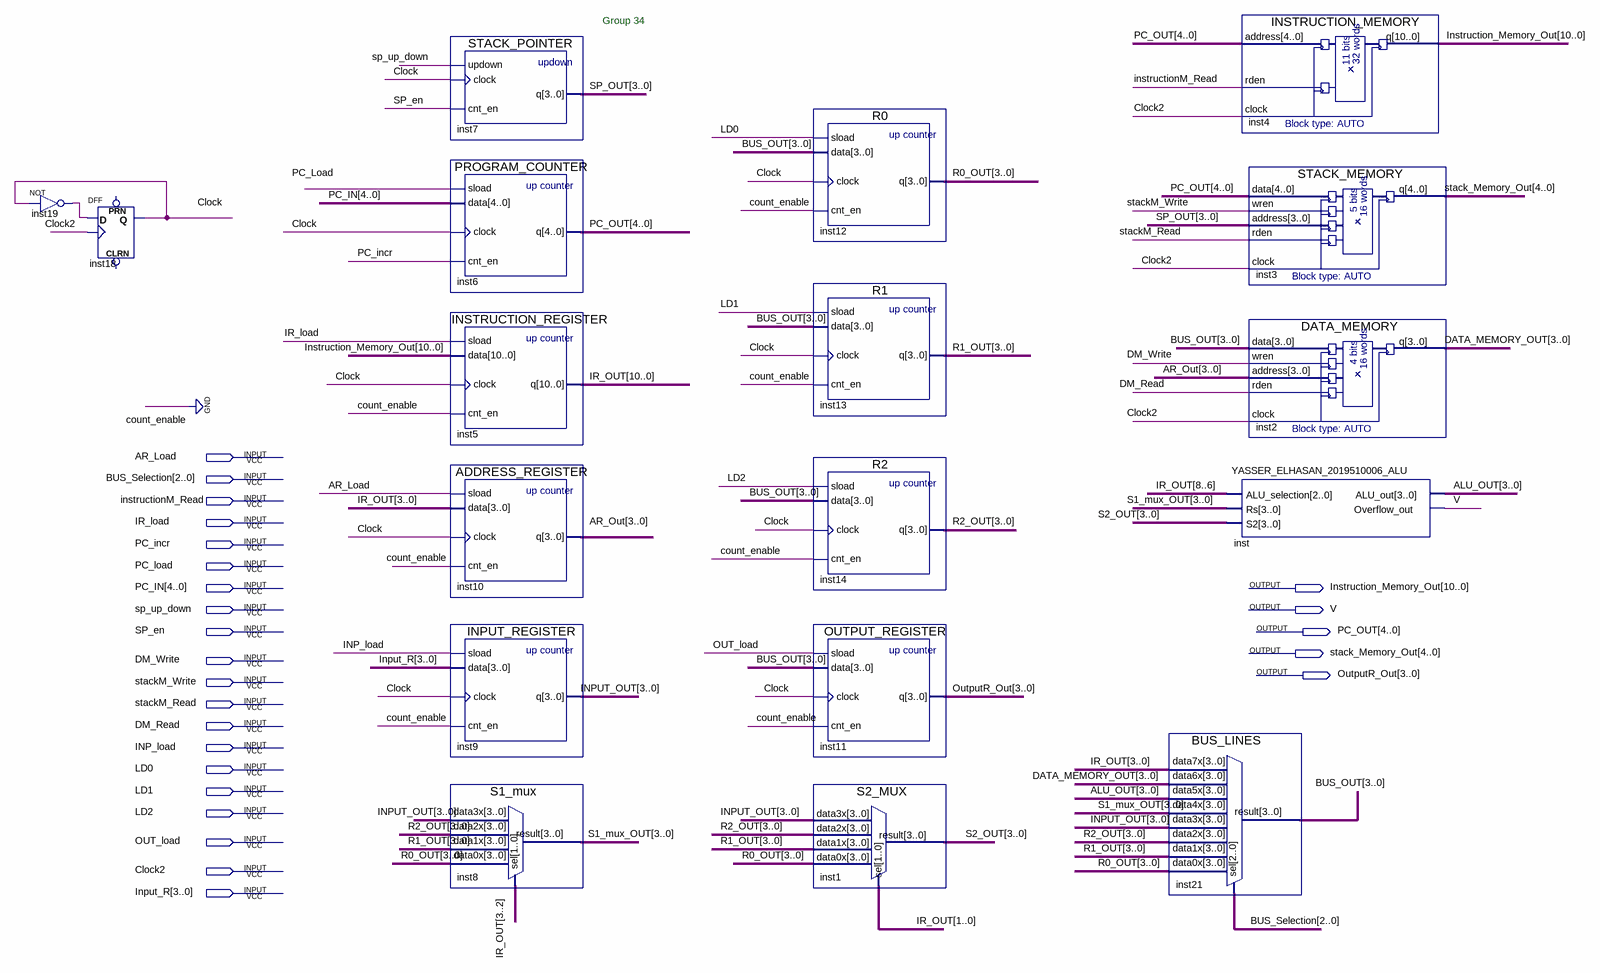
[diagram p0: schematic sheet]
// Quartus schematic Common_Bus_System_YASSER_ELHASAN_2019510006_Group7.bdf as structural Verilog: 18 symbols, 25 pins
module Common_Bus_System_YASSER_ELHASAN_2019510006_Group7 (
  input  AR_Load,
  input  [2:0] BUS_Selection,
  input  instructionM_Read,
  input  IR_load,
  input  PC_incr,
  input  PC_load,
  input  [4:0] PC_IN,
  input  sp_up_down,
  input  SP_en,
  input  DM_Write,
  input  stackM_Write,
  input  stackM_Read,
  input  DM_Read,
  input  INP_load,
  input  LD0,
  input  LD1,
  input  LD2,
  input  OUT_load,
  input  Clock2,
  input  [3:0] Input_R,
  output [10:0] Instruction_Memory_Out,
  output V,
  output [4:0] PC_OUT,
  output [4:0] stack_Memory_Out,
  output [3:0] OutputR_Out
);

  wire Clock, inst19_out;
  wire [3:0] ALU_OUT, AR_Out, BUS_OUT, DATA_MEMORY_OUT, INPUT_OUT, R0_OUT, R1_OUT, R2_OUT, S1_mux_OUT,
       S2_OUT, SP_OUT;
  wire [10:0] IR_OUT;

  not inst19 (inst19_out, Clock);
  DFF inst18 (.CLK(Clock2), .D(inst19_out), .Q(Clock));  // open: CLRN, PRN
  STACK_POINTER inst7 (.updown(sp_up_down), .clock(Clock), .cnt_en(SP_en), .q(SP_OUT));
  PROGRAM_COUNTER inst6 (.sload(PC_load), .data(PC_IN), .clock(Clock), .cnt_en(PC_incr), .q(PC_OUT));
  INSTRUCTION_REGISTER inst5 (.sload(IR_load), .data(Instruction_Memory_Out), .clock(Clock), .cnt_en(1'b0), .q(IR_OUT));
  ADDRESS_REGISTER inst10 (.sload(AR_Load), .data(IR_OUT[3:0]), .clock(Clock), .cnt_en(1'b0), .q(AR_Out));
  INPUT_REGISTER inst9 (.sload(INP_load), .data(Input_R), .clock(Clock), .cnt_en(1'b0), .q(INPUT_OUT));
  S1_mux inst8 (
    .data3x(INPUT_OUT), .data2x(R2_OUT), .data1x(R1_OUT), .data0x(R0_OUT), .sel(IR_OUT[3:2]),
    .result(S1_mux_OUT));
  R0 inst12 (.sload(LD0), .data(BUS_OUT), .clock(Clock), .cnt_en(1'b0), .q(R0_OUT));
  R1 inst13 (.sload(LD1), .data(BUS_OUT), .clock(Clock), .cnt_en(1'b0), .q(R1_OUT));
  R2 inst14 (.sload(LD2), .data(BUS_OUT), .clock(Clock), .cnt_en(1'b0), .q(R2_OUT));
  OUTPUT_REGISTER inst11 (.sload(OUT_load), .data(BUS_OUT), .clock(Clock), .cnt_en(1'b0), .q(OutputR_Out));
  S2_MUX inst1 (
    .data3x(INPUT_OUT), .data2x(R2_OUT), .data1x(R1_OUT), .data0x(R0_OUT), .sel(IR_OUT[1:0]), .result(S2_OUT));
  BUS_LINES inst21 (
    .data7x(IR_OUT[3:0]), .data6x(DATA_MEMORY_OUT), .data5x(ALU_OUT), .data4x(S1_mux_OUT),
    .data3x(INPUT_OUT), .data2x(R2_OUT), .data1x(R1_OUT), .data0x(R0_OUT), .sel(BUS_Selection),
    .result(BUS_OUT));
  YASSER_ELHASAN_2019510006_ALU inst (
    .ALU_selection(IR_OUT[8:6]), .Rs(S1_mux_OUT), .S2(S2_OUT), .ALU_out(ALU_OUT), .Overflow_out(V));
  INSTRUCTION_MEMORY inst4 (.address(PC_OUT), .rden(instructionM_Read), .clock(Clock2), .q(Instruction_Memory_Out));
  STACK_MEMORY inst3 (
    .data(PC_OUT), .wren(stackM_Write), .address(SP_OUT), .rden(stackM_Read), .clock(Clock2),
    .q(stack_Memory_Out));
  DATA_MEMORY inst2 (
    .data(BUS_OUT), .wren(DM_Write), .address(AR_Out), .rden(DM_Read), .clock(Clock2), .q(DATA_MEMORY_OUT));

  // Notes on the sheet:
  //   Group 34
endmodule
